# EAGLE design R-schematic (EAGLE 7.7.0)
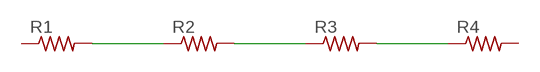
[diagram p0: schematic, sheet 1]

## Parts
R1  R-US_M1206  [M1206]
R2  R-US_M1206  [M1206]
R3  R-US_M1206  [M1206]
R4  R-US_M1206  [M1206]

## Nets
PAD$A1: R1.2 R2.1
PAD$B1: R3.2 R4.1
PAD$C1: R2.2 R3.1
Unconnected: R1.1 R4.2

## Library data of the parts
R1-R4 = resistor:R-US_: RESISTOR, American symbol

## Board
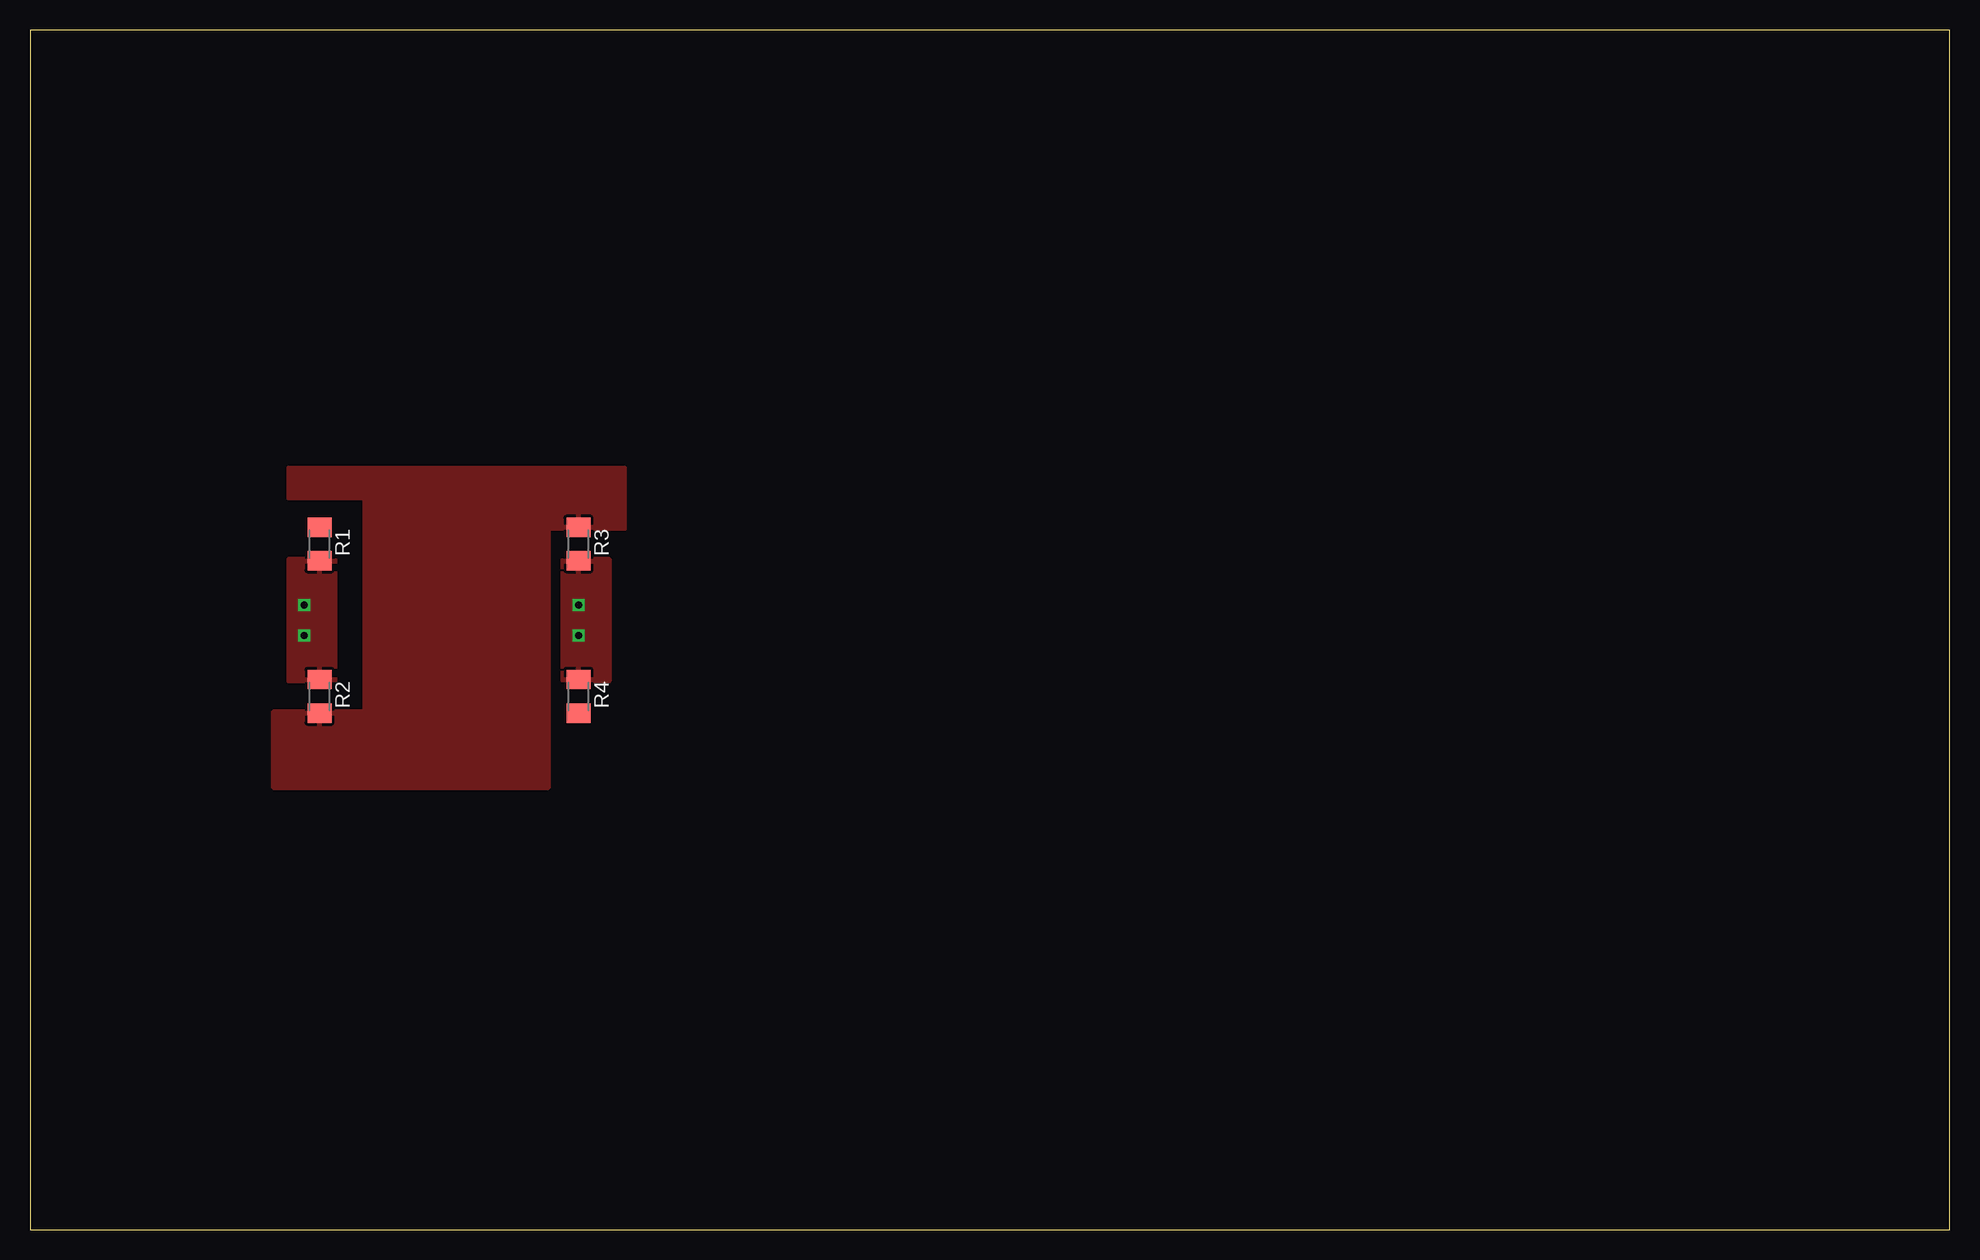
[diagram p1: board, top side]
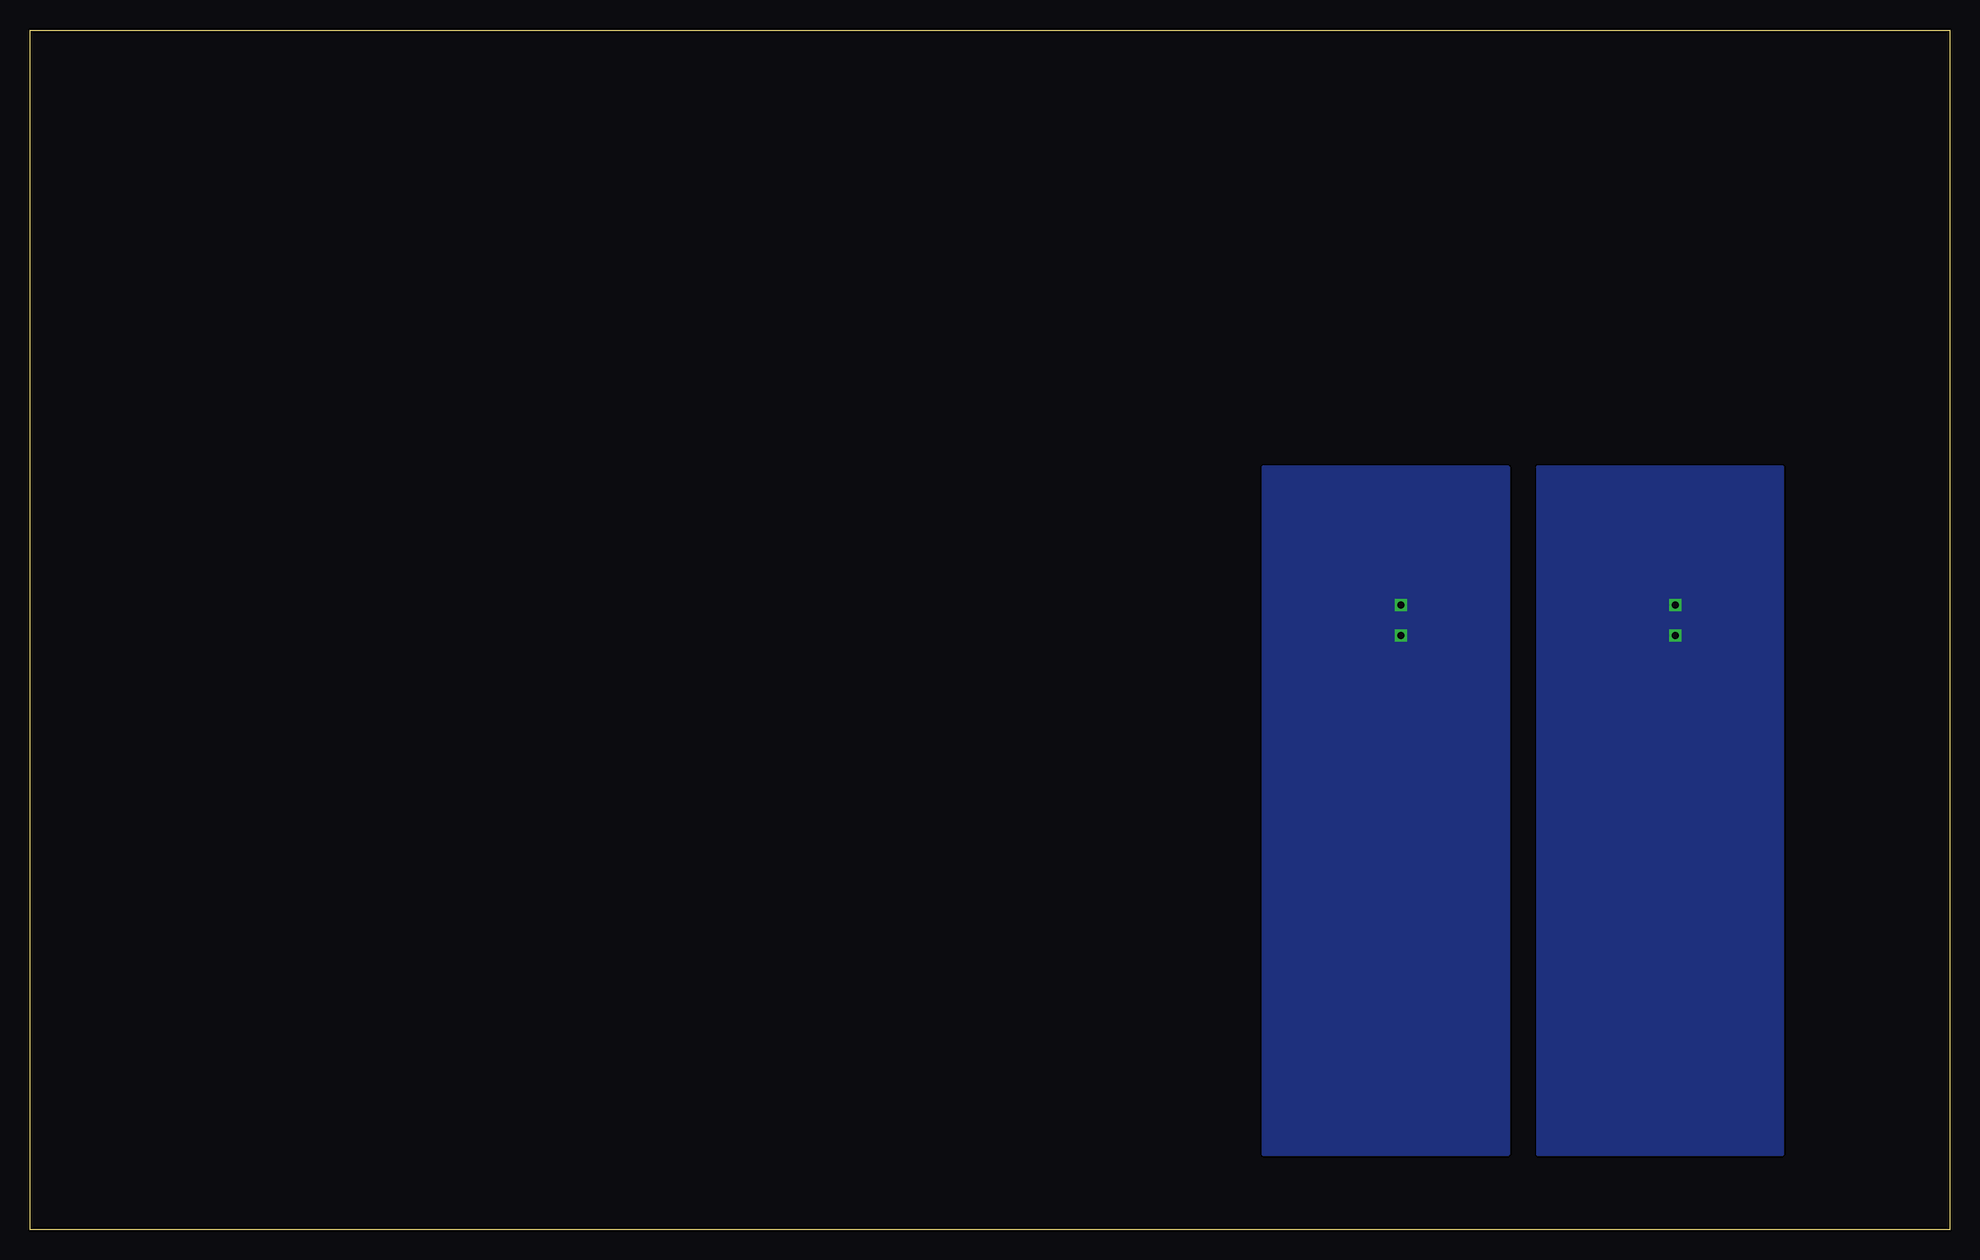
[diagram p2: board, bottom side, seen from below]

Size 160 x 100 mm. Coordinates in mm from the lower left corner, seen from the top.
Outline: 0,0 160,0 160,100 0,100 0,0
Copper layers (1*16): Top 0.035mm / dielectric 1.5mm / Bottom 0.035mm
Design rules "default": minimum track width 10mil, minimum drill 24mil, track to track 8mil, track to pad 8mil, pad to pad 8mil, via to via 8mil, smd to smd 8mil, copper to edge 40mil, drill to drill 8mil, minimum pad ring 10mil, minimum via ring 8mil, stop-mask expansion 4mil, vias tented up to drill 0mil, thermal gap 10mil

### Footprints (pad centres in the part's own frame; a part is rotated, then mirrored left to right if it is on the bottom)
M1206 = smd 1.6 x 2: 1 -1.4,0; 2 1.4,0

### Placement (x,y rotation side)
R1  24.13,57.15 270 top
R2  24.13,44.45 270 top
R3  45.72,57.15 270 top
R4  45.72,44.45 270 top

### Tracks (layer width: path | path; a pad name or v marks a point on that pad's centre or on a via)
PAD$A1  (via drill 0.6)
  other vias: 22.86,52.07 22.86,49.53
  pour Bottom: 13.97,63.5 33.02,63.5 34.29,63.5 34.29,6.35 15.24,6.35 13.97,6.35
  pour Top: 21.59,55.88 25.4,55.88 25.4,45.72 21.59,45.72
PAD$B1  (via drill 0.6)
  other vias: 45.72,52.07 45.72,49.53
  pour Top: 44.45,55.88 48.26,55.88 48.26,45.72 44.45,45.72
  pour Bottom: 36.83,63.5 55.88,63.5 57.15,63.5 57.15,6.35 38.1,6.35 36.83,6.35
PAD$C1
  pour Top: 21.59,63.5 49.53,63.5 49.53,58.42 43.18,58.42 43.18,36.83 20.32,36.83 20.32,43.18 27.94,43.18 27.94,60.96 21.59,60.96